# EasyEDA Pro project Schematic.epro

# Schematic Schematic1
Board Name: Board1; Create Date: 2026-01-22; Page Name: P1; Project Name: HackClub Macropad; Schematic Name: Schematic1; Update Date: 2026-01-29; Company: EasyEDA.com; Page Size: A4; Version: V1.0
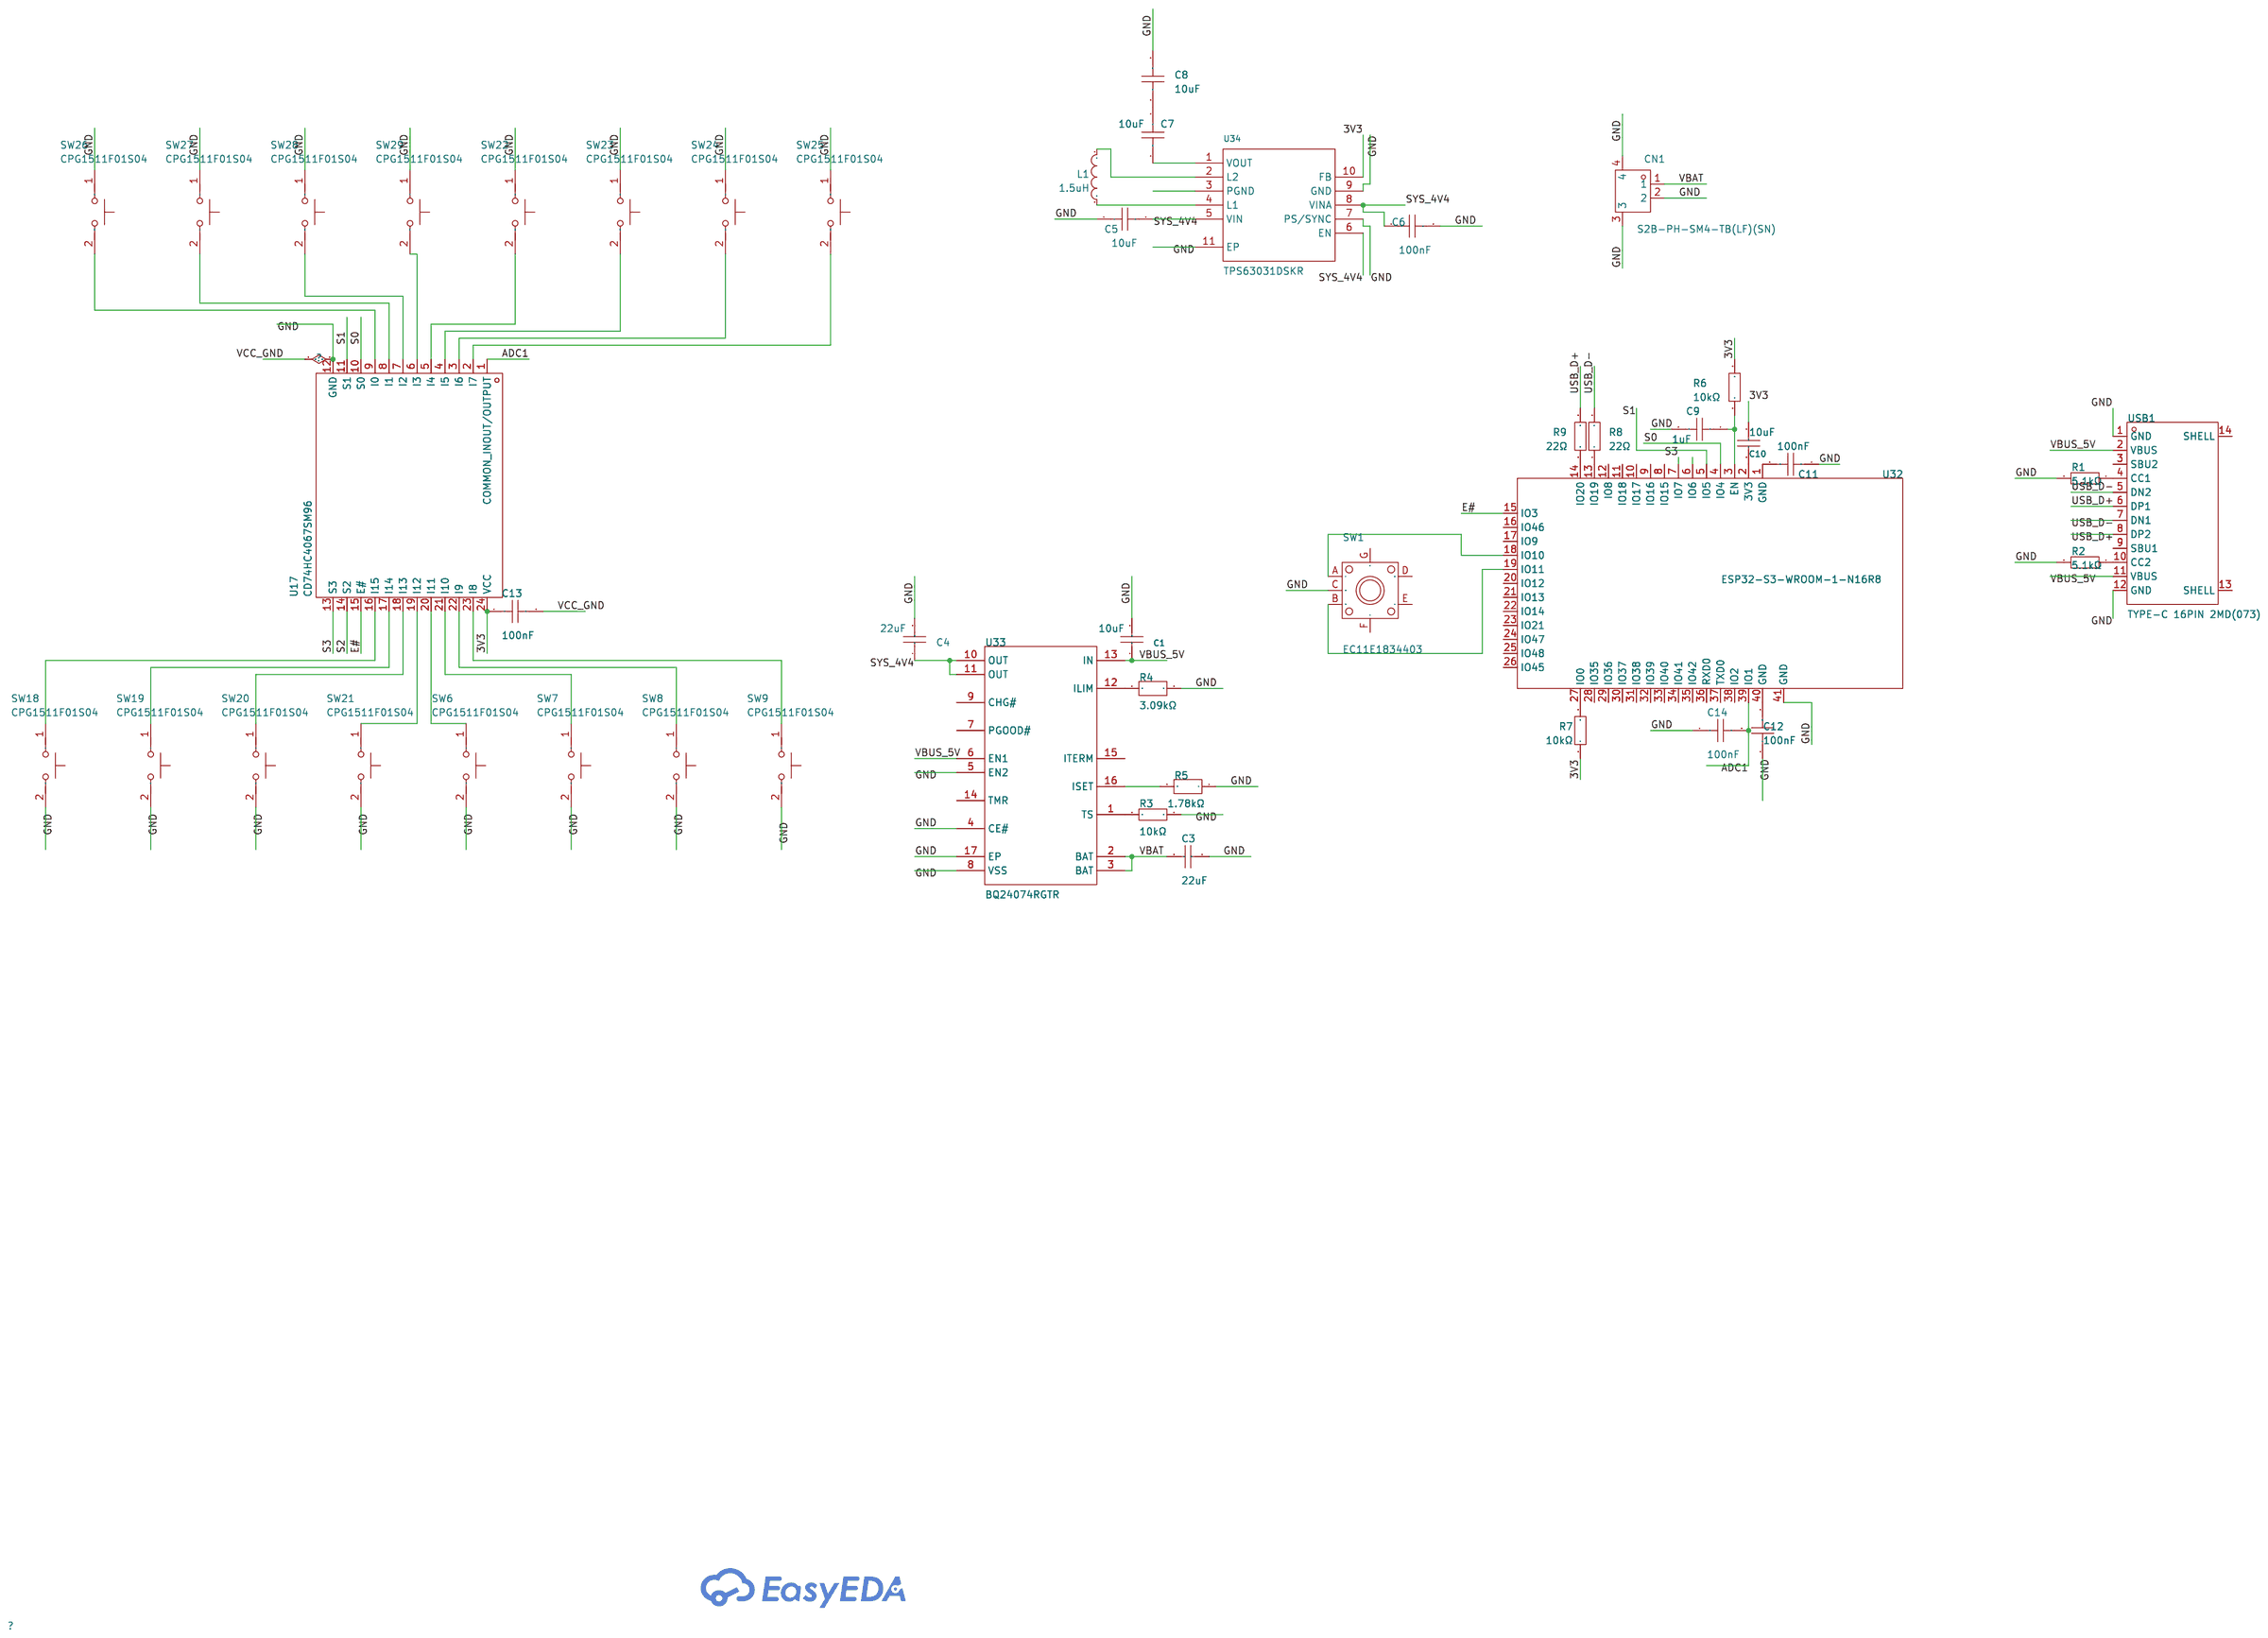
[diagram p0: schematic sheet]

## Parts
C1  10uF  [C0805]
C3  22uF  [C0805]
C4  22uF  [C0805]
C5  10uF  [C0603]
C6  100nF  [C0805]
C7  10uF  [C0603]
C8  10uF  [C0603]
C9  1uF  [C0402]
C10  10uF  [C0805]
C11  100nF  [C0402]
C12  100nF  [C0402]
C13  100nF  [C0402]
C14  100nF  [C0402]
CN1  S2B-PH-SM4-TB(LF)(SN)  [CONN-SMD_P2.00_S2B-PH-SM4-TB-LF-SN]
L1  1.5uH  [IND-SMD_L4.0-W4.0-A]
R1  5.1kΩ  [R0603]
R2  5.1kΩ  [R0603]
R3  10kΩ  [R0805]
R4  3.09kΩ  [R0805]
R5  1.78kΩ  [R1206]
R6  10kΩ  [R0805]
R7  10kΩ  [R0805]
R8  22Ω  [R0402]
R9  22Ω  [R0402]
SW1  EC11E1834403  [SW-TH_EC11E1820402]
SW6  CPG1511F01S04  [KEY-TH_CPG1511F01S0X]
SW7  CPG1511F01S04  [KEY-TH_CPG1511F01S0X]
SW8  CPG1511F01S04  [KEY-TH_CPG1511F01S0X]
SW9  CPG1511F01S04  [KEY-TH_CPG1511F01S0X]
SW18  CPG1511F01S04  [KEY-TH_CPG1511F01S0X]
SW19  CPG1511F01S04  [KEY-TH_CPG1511F01S0X]
SW20  CPG1511F01S04  [KEY-TH_CPG1511F01S0X]
SW21  CPG1511F01S04  [KEY-TH_CPG1511F01S0X]
SW22  CPG1511F01S04  [KEY-TH_CPG1511F01S0X]
SW23  CPG1511F01S04  [KEY-TH_CPG1511F01S0X]
SW24  CPG1511F01S04  [KEY-TH_CPG1511F01S0X]
SW25  CPG1511F01S04  [KEY-TH_CPG1511F01S0X]
SW26  CPG1511F01S04  [KEY-TH_CPG1511F01S0X]
SW27  CPG1511F01S04  [KEY-TH_CPG1511F01S0X]
SW28  CPG1511F01S04  [KEY-TH_CPG1511F01S0X]
SW29  CPG1511F01S04  [KEY-TH_CPG1511F01S0X]
U17  CD74HC4067SM96  [SSOP-24_L8.1-W5.3-P0.65-LS7.8-BL]
U32  ESP32-S3-WROOM-1-N16R8  [WIRELM-SMD_ESP32-S3-WROOM-1]
U33  BQ24074RGTR  [QFN-16_L3.0-W3.0-P0.50-TL-EP1.7]
U34  TPS63031DSKR  [SON-10_L2.5-W2.5-P0.50-TL-EP]
USB1  TYPE-C 16PIN 2MD(073)  [USB-C-SMD_TYPE-C-6PIN-2MD-073]

## Library data of the parts
C1 C10 = CC0805KKX5R7BB106: Capacitance:10uF Tolerance:±10% Tolerance:±10% Voltage Rating:16V Temperature Coefficient:X5R; LCSC Part Name: 10uF ±10% 16V; Supplier Part: C89827; Manufacturer: YAGEO(国巨); Supplier Footprint: 0805; JLCPCB Part Class: Extended Part; Datasheet: https://item.szlcsc.com/datasheet/CC0805KKX5R7BB106/91009.html; Supplier: LCSC; Tolerance: ±10%; Voltage Rating: 16V; Temperature Coefficient: X5R
C3 C4 = CL21A226MPQNNNE: Capacitance:22uF Tolerance:±20% Tolerance:±20% Voltage Rating:10V Temperature Coefficient:X5R; LCSC Part Name: 22uF ±20% 10V; Supplier Part: C29277; Manufacturer: SAMSUNG(三星); Supplier Footprint: 0805; JLCPCB Part Class: Extended Part; Datasheet: https://item.szlcsc.com/datasheet/CL21A226MPQNNNE/30029.html; Supplier: LCSC; Tolerance: ±20%; Voltage Rating: 10V; Temperature Coefficient: X5R
C5 C7 C8 = CL10A106KP8NNNC: Capacitance:10uF Tolerance:±10% Tolerance:±10% Voltage Rating:10V Temperature Coefficient:X5R; LCSC Part Name: 10uF ±10% 10V; Supplier Part: C19702; Manufacturer: SAMSUNG(三星); Supplier Footprint: 0603; JLCPCB Part Class: Basic Part; Datasheet: https://item.szlcsc.com/datasheet/CL10A106KP8NNNC/20411.html; Supplier: LCSC; Tolerance: ±10%; Voltage Rating: 10V; Temperature Coefficient: X5R
C6 = CC0805KRX7R9BB104: Capacitance:100nF Tolerance:±10% Tolerance:±10% Voltage Rating:50V Temperature Coefficient:X7R; LCSC Part Name: 100nF ±10% 50V; Supplier Part: C49678; Manufacturer: YAGEO(国巨); Supplier Footprint: 0805; JLCPCB Part Class: Basic Part; Datasheet: https://item.szlcsc.com/datasheet/CC0805KRX7R9BB104/50686.html; Supplier: LCSC; Tolerance: ±10%; Voltage Rating: 50V; Temperature Coefficient: X7R
C9 = 0402X105K160NT: Capacitance:1uF Tolerance:±10% Tolerance:±10% Voltage Rating:16V Temperature Coefficient:X5R; LCSC Part Name: 1uF ±10% 16V; Supplier Part: C167339; Manufacturer: FH(风华); Supplier Footprint: 0402; JLCPCB Part Class: Extended Part; Datasheet: https://item.szlcsc.com/datasheet/0402X105K160NT/178722.html; Supplier: LCSC; Tolerance: ±10%; Voltage Rating: 16V; Temperature Coefficient: X5R
C11-C14 = CL05B104KB54PNC: Capacitance:100nF Tolerance:±10% Tolerance:±10% Voltage Rating:50V Temperature Coefficient:X7R; LCSC Part Name: 100nF ±10% 50V; Supplier Part: C307331; Manufacturer: SAMSUNG(三星); Supplier Footprint: 0402; JLCPCB Part Class: Basic Part; Datasheet: https://item.szlcsc.com/datasheet/CL05B104KB54PNC/291005.html; Supplier: LCSC; Tolerance: ±10%; Voltage Rating: 50V; Temperature Coefficient: X7R
CN1 = S2B-PH-SM4-TB(LF)(SN): Pins Structure:1x2P Pitch:2mm Mounting Style:Horizontal attachment Reference Series:PH Number of Pins:2P Number of Rows:1 Number of PINs Per Row:2 Row Spacing:- Current Rating (Max):2A Contact Material:Copper alloy Contact Plating:Tin Operating Temperatur; LCSC Part Name: 1x2P 间距:2mm 卧贴 系列:PH; Supplier Part: C295747; Manufacturer: JST; Supplier Footprint: SMD,P=2mm,卧贴; JLCPCB Part Class: Extended Part; Datasheet: https://atta.szlcsc.com/upload/public/pdf/source/20210203/C295747_344B2E64535E381E727D98C302AB61C7.pdf; Supplier: LCSC; Pins Structure: 1x2P; Pitch: 2mm; Mounting Style: Horizontal attachment; Reference Series: PH; Number of Pins: 2P; Number of Rows: 1; Number of PINs Per Row: 2; Current Rating (Max): 2A; Contact Material: Copper alloy; Contact Plating: Tin; Operating Temperature Range: -25℃~+85℃; Rated Voltage (Max): 100V; Plastic Material: PA; Flame Retardant Rating: UL94V-0; Supplementary Features: Auxiliary soldering legs; Colour: Beige; Z-Height of the Board: 5.5mm; X-Length of Bottom Edge on Board (Spacing Line): 7.9mm; Y-Width of Bottom Edge on Board: 8.6mm
L1 = XFL4020-152MEC: Inductance:1.5uH Tolerance:±20% Tolerance:±20% Current Rating:- Current - Saturation(Isat):- DC Resistance(DCR):- Type:Magnetic Shielded Inductor Ratings:-; LCSC Part Name: 1.5uH ±20%; Supplier Part: C3033018; Manufacturer: Coilcraft(线艺); Supplier Footprint: SMD,4x4mm; JLCPCB Part Class: Extended Part; Datasheet: https://www.coilcraft.com/getmedia/50632d43-da1b-4cdb-8ab4-3029cab51df3/xfl4020.pdf; Supplier: LCSC; Tolerance: ±20%; Type: Magnetic Shielded Inductor
R1 R2 = 0603WAF5101T5E: Type:Thick Film Resistor Resistance:5.1kΩ Tolerance:±1% Tolerance:±1% Power(Watts):100mW Voltage-Supply(Max):75V Temperature Coefficient:±100ppm/℃ Temperature Coefficient:±100ppm/℃ Operating Temperature:-55℃~+155℃ Operating Temperature:-55℃~+155℃; LCSC Part Name: 5.1kΩ ±1% 100mW 厚膜电阻; Supplier Part: C23186; Manufacturer: UNI-ROYAL(厚声); Supplier Footprint: 0603; JLCPCB Part Class: Basic Part; Datasheet: https://item.szlcsc.com/datasheet/0603WAF5101T5E/23913.html; Supplier: LCSC; Type: Thick Film Resistor; Tolerance: ±1%; Power(Watts): 100mW; Voltage-Supply(Max): 75V; Temperature Coefficient: ±100ppm/℃; Operating Temperature: -55℃~+155℃
R3 = 0805W8F1002T5E: Type:Thick Film Resistor Resistance:10kΩ Tolerance:±1% Tolerance:±1% Power(Watts):125mW Voltage-Supply(Max):150V Temperature Coefficient:±100ppm/℃ Temperature Coefficient:±100ppm/℃ Operating Temperature:-55℃~+155℃ Operating Temperature:-55℃~+155℃; LCSC Part Name: 10kΩ ±1% 125mW 厚膜电阻; Supplier Part: C17414; Manufacturer: UNI-ROYAL(厚声); Supplier Footprint: 0805; JLCPCB Part Class: Basic Part; Datasheet: https://item.szlcsc.com/datasheet/0805W8F1002T5E/18102.html; Supplier: LCSC; Type: Thick Film Resistor; Tolerance: ±1%; Power(Watts): 125mW; Voltage-Supply(Max): 150V; Temperature Coefficient: ±100ppm/℃; Operating Temperature: -55℃~+155℃
R4 = RT0805BRD073K09L: Type:Thin Film Resistor Resistance:3.09kΩ Tolerance:±0.1% Tolerance:±0.1% Power(Watts):125mW Temperature Coefficient:±25ppm/℃ Temperature Coefficient:±25ppm/℃ Operating Temperature:-55℃~+155℃ Operating Temperature:-55℃~+155℃; LCSC Part Name: 薄膜电阻 3.09kΩ ±0.1% 125mW; Supplier Part: C865456; Manufacturer: YAGEO(国巨); Supplier Footprint: 0805; JLCPCB Part Class: Extended Part; Datasheet: https://item.szlcsc.com/datasheet/RT0805BRD073K09L/925537.html; Supplier: LCSC; Type: Thin Film Resistor; Tolerance: ±0.1%; Power(Watts): 125mW; Temperature Coefficient: ±25ppm/℃; Operating Temperature: -55℃~+155℃
R5 = RT1206BRD071K78L: Type:Thin Film Resistor Resistance: Tolerance:±0.1% Tolerance:±0.1% Power(Watts):250mW Overload Voltage (Max): Temperature Coefficient:±25ppm/℃ Temperature Coefficient:±25ppm/℃ Operating Temperature Range:-55℃~+155℃ Operating Temperature Range:-55℃~+155℃; LCSC Part Name: 薄膜电阻 1.78kΩ ±0.1% 250mW; Supplier Part: C706404; Manufacturer: YAGEO(国巨); Supplier Footprint: 1206; JLCPCB Part Class: Extended Part; Datasheet: https://atta.szlcsc.com/upload/public/pdf/source/20200720/C706404_090B223C8D5F603C04EDF7E7249F9860.pdf; Supplier: LCSC; Type: Thin Film Resistor; Tolerance: ±0.1%; Power(Watts): 250mW; Temperature Coefficient: ±25ppm/℃; Operating Temperature Range: -55℃~+155℃
R6 R7 = RC0805FR-0710KL: Type:Thick Film Resistor Resistance:10kΩ Tolerance:±1% Tolerance:±1% Power(Watts):125mW Voltage-Supply(Max):150V Temperature Coefficient:±100ppm/℃ Temperature Coefficient:±100ppm/℃ Operating Temperature:-55℃~+155℃ Operating Temperature:-55℃~+155℃; LCSC Part Name: 厚膜电阻 10kΩ ±1% 125mW; Supplier Part: C84376; Manufacturer: YAGEO(国巨); Supplier Footprint: 0805; JLCPCB Part Class: Extended Part; Datasheet: https://item.szlcsc.com/datasheet/RC0805FR-0710KL/85546.html; Supplier: LCSC; Type: Thick Film Resistor; Tolerance: ±1%; Power(Watts): 125mW; Voltage-Supply(Max): 150V; Temperature Coefficient: ±100ppm/℃; Operating Temperature: -55℃~+155℃
R8 R9 = RC0402FR-0722RL: Type:Thick Film Resistors Resistance: Tolerance:±1% Tolerance:±1% Power(Watts): Overload Voltage (Max): Temperature Coefficient:±100ppm/℃ Temperature Coefficient:±100ppm/℃ Operating Temperature Range:-55℃~+155℃ Operating Temperature Range:-55℃~+155℃; LCSC Part Name: 厚膜电阻 22Ω ±1% 62.5mW; Supplier Part: C114765; Manufacturer: YAGEO(国巨); Supplier Footprint: 0402; JLCPCB Part Class: Extended Part; Datasheet: https://atta.szlcsc.com/upload/public/pdf/source/20180821/C275644_0D56F95EFF785E7D9A1FEF436B37DA78.pdf; Supplier: LCSC; Type: Thick Film Resistors; Tolerance: ±1%; Temperature Coefficient: ±100ppm/℃; Operating Temperature Range: -55℃~+155℃
SW1 = EC11E1834403: LCSC Part Name: 编码器; Supplier Part: C361165; Manufacturer: ALPSALPINE(阿尔卑斯阿尔派); Supplier Footprint: 插件; JLCPCB Part Class: Extended Part; Datasheet: https://atta.szlcsc.com/upload/public/pdf/source/20190109/C361167_8025A1363C62EF4BA37C0EA12E1AE3EA.pdf; Supplier: LCSC
SW6-SW9 SW18-SW29 = CPG1511F01S04: Axis Type:Red axis Operating Voltage:2V~12V Operating Voltage:2V~12V Pin:2 Mechanical Life:80 million times Operation Force:45gf@±10gf Conduction Travel:1.8mm Total Travel:3.6mm Operating Temperature:-10℃~+70℃ Operating Temperature:-10℃~+70℃; LCSC Part Name: BOX 红轴; Supplier Part: C400226; Manufacturer: Kailh(凯华); Supplier Footprint: 插件; JLCPCB Part Class: Extended Part; Datasheet: https://atta.szlcsc.com/upload/public/pdf/source/20190626/C400226_74917CF00C09065EB4010B1E948F36C3.pdf; Supplier: LCSC; Axis Type: Red axis; Operating Voltage: 2V~12V; Pin: 2; Mechanical Life: 80 million times; Operation Force: 45gf@±10gf; Conduction Travel: 1.8mm; Total Travel: 3.6mm; Operating Temperature: -10℃~+70℃
U17 = CD74HC4067SM96: Switch Circuit:16:1 Number of Channels:16 Voltage - Supply:2V~6V Voltage - Supply:2V~6V Turn-on time:- Ron:70Ω Turn-off time:- Operating Temperature:-55℃~+125℃ Operating Temperature:-55℃~+125℃ Con:5pF Bandwidth:89MHz Propagation Delay (tpd):15ns; LCSC Part Name: 高速CMOS逻辑16通道模拟多路复用器/解复用器; Supplier Part: C98457; Manufacturer: TI(德州仪器); Supplier Footprint: SSOP-24-208mil; JLCPCB Part Class: Extended Part; Datasheet: https://www.ti.com/cn/lit/gpn/cd74hc4067; Supplier: LCSC; Switch Circuit: 16:1; Number of Channels: 16; Voltage - Supply: 2V~6V; Ron: 70Ω; Operating Temperature: -55℃~+125℃; Con: 5pF; Bandwidth: 89MHz; Propagation Delay (tpd): 15ns
U32 = ESP32-S3-WROOM-1-N16R8: LCSC Part Name: 通用型Wi-Fi+低功耗蓝牙MCU模组; Supplier Part: C2913202; Manufacturer: ESPRESSIF(乐鑫); Supplier Footprint: SMD,25.5x18mm; JLCPCB Part Class: Extended Part; Datasheet: https://item.szlcsc.com/datasheet/ESP32-S3-WROOM-1-N16R8/3198300.html; Supplier: LCSC
U33 = BQ24074RGTR: The Chip Type:- Voltage - Supply:4.35V~26V Voltage - Supply:4.35V~26V Charge Current - Max:- Charging Saturation Voltage:4.2V Type of Battery:Lithium-ion/Polymer Number of Cells:1 Number of Cells:1 Operating Temperature:-40℃~+85℃ Operating Temperature:-40; LCSC Part Name: USB友好型1.5A锂离子电池充电器和电源路径管理IC; Supplier Part: C54313; Manufacturer: TI(德州仪器); Supplier Footprint: QFN-16-EP(3x3); JLCPCB Part Class: Extended Part; Datasheet: https://www.ti.com/cn/lit/gpn/bq24074; Supplier: LCSC; Voltage - Supply: 4.35V~26V; Charging Saturation Voltage: 4.2V; Type of Battery: Lithium-ion/Polymer; Number of Cells: 1; Operating Temperature: -40℃~+85℃
U34 = TPS63031DSKR: Function:Buck-Boost Voltage - Supply:1.8V~5.5V Voltage - Supply:1.8V~5.5V Output Voltage:3.3V Output Voltage:3.3V Output Current:900mA Frequency - Switching:2.4MHz Frequency - Switching:2.4MHz Operating Temperature:-40℃~+125℃@(TJ) Operating Temperature:-4; LCSC Part Name: 高效单电感降 压-升压转换器; Supplier Part: C15516; Manufacturer: TI(德州仪器); Supplier Footprint: SON-10-EP(2.5x2.5); JLCPCB Part Class: Extended Part; Datasheet: https://www.ti.com/cn/lit/gpn/tps63031; Supplier: LCSC; Function: Buck-Boost; Voltage - Supply: 1.8V~5.5V; Output Voltage: 3.3V; Output Current: 900mA; Frequency - Switching: 2.4MHz; Operating Temperature: -40℃~+125℃@(TJ); Synchronous Rectifier: Yes; Number of Outputs: 1; Topology: Buck-Boost; Quiescent Current: 25uA; Switch tube (built-in/external): Built-in; Output Type: Fixed
USB1 = TYPE-C 16PIN 2MD(073): Connector Type:Type-C Protocol Standard:- Gender:Female Mounting Type:Surface Mount, Right Angle Number of Contacts:16P Number of Ports:1 Current Rating-Power:3A Voltage Rating:5V Connect-Disconnect Life:5,000 times Supplementary Features:- Center Height:; LCSC Part Name: 16P卧贴母座; Supplier Part: C2765186; Manufacturer: SHOU HAN(首韩); Supplier Footprint: SMD; JLCPCB Part Class: Extended Part; Datasheet: https://item.szlcsc.com/datasheet/TYPE-C%252016PIN%25202MD(073)/2901843.html; Supplier: LCSC; Connector Type: Type-C; Gender: Female; Mounting Type: Surface Mount, Right Angle; Number of Contacts: 16P; Number of Ports: 1; Current Rating-Power: 3A; Voltage Rating: 5V; Connect-Disconnect Life: 5,000 times; Detection color: Black; Operating Temperature: -25℃~+85℃

## Nets
3V3: C10.2 C13.1 R6.2 R7.1 U17.24(VCC) U34.10(FB)
GND: C1.2 C3.2 C4.2 C5.1 C6.2 C8.2 C9.2 C11.1 C12.1 C13.2 C14.1 CN1.2 CN1.3 CN1.4 R1.2 R2.2 R3.2 R4.2 R5.1 SW1.C SW6.2 SW7.2 SW8.2 SW9.2 SW18.2 SW19.2 SW20.2 SW21.2 SW22.1 SW23.1 SW24.1 SW25.1 SW26.1 SW27.1 SW28.1 SW29.1 U17.12(GND) U32.41(GND) U33.4(CE#) U33.5(EN2) U33.8(VSS) U33.17(EP) U34.7(PS/SYNC) U34.9(GND) U34.11(EP) USB1.1(GND) USB1.12(GND)
VBAT: C3.1 CN1.1 U33.2(BAT) U33.3(BAT)
VBUS_5V: C1.1 U33.6(EN1) U33.13(IN) USB1.2(VBUS) USB1.11(VBUS)
ADC1: C14.2 U17.1(COMMON INOUT/OUTPUT) U32.39(IO1)
E#: U17.15(E#) U32.15(IO3)
S0: U17.10(S0) U32.4(IO4)
S1: U17.11(S1) U32.5(IO5)
S2: U17.14(S2)
S3: U17.13(S3) U32.7(IO7)
SYS_4V4: C4.1 C5.2 C6.1 U33.10(OUT) U33.11(OUT) U34.5(VIN) U34.6(EN) U34.8(VINA)
USB_D+: R9.2 USB1.6(DP1) USB1.8(DP2)
USB_D-: R8.2 USB1.5(DN2) USB1.7(DN1)
Net-(C7-1): C7.1 U34.1(VOUT)
Net-(C7-2): C7.2 C8.1
Net-(C9-1): C9.1 R6.1 U32.3(EN)
Net-(C10-1): C10.1 U32.2(3V3)
Net-(C11-2): C11.2 U32.1(GND)
Net-(C12-2): C12.2 U32.40(GND)
Net-(L1-1): L1.1 U34.2(L2)
Net-(L1-2): L1.2 U34.4(L1)
Net-(R1-1): R1.1 USB1.4(CC1)
Net-(R2-1): R2.1 USB1.10(CC2)
Net-(R3-1): R3.1 U33.1(TS)
Net-(R4-1): R4.1 U33.12(ILIM)
Net-(R5-2): R5.2 U33.16(ISET)
Net-(R7-2): R7.2 U32.27(IO0)
Net-(R8-1): R8.1 U32.13(IO19)
Net-(R9-1): R9.1 U32.14(IO20)
Net-(SW1-A): SW1.A U32.18(IO10)
Net-(SW1-B): SW1.B U32.19(IO11)
Net-(SW6-1): SW6.1 U17.20(I11)
Net-(SW7-1): SW7.1 U17.21(I10)
Net-(SW8-1): SW8.1 U17.22(I9)
Net-(SW9-1): SW9.1 U17.23(I8)
Net-(SW18-1): SW18.1 U17.16(I15)
Net-(SW19-1): SW19.1 U17.17(I14)
Net-(SW20-1): SW20.1 U17.18(I13)
Net-(SW21-1): SW21.1 U17.19(I12)
Net-(SW22-2): SW22.2 U17.5(I4)
Net-(SW23-2): SW23.2 U17.4(I5)
Net-(SW24-2): SW24.2 U17.3(I6)
Net-(SW25-2): SW25.2 U17.2(I7)
Net-(SW26-2): SW26.2 U17.9(I0)
Net-(SW27-2): SW27.2 U17.8(I1)
Net-(SW28-2): SW28.2 U17.7(I2)
Net-(SW29-2): SW29.2 U17.6(I3)

Not connected (* = marked no-connect by the designer): SW1 D E F G; U32 6(IO6) 8(IO15) 9(IO16) 10(IO17) 11(IO18) 12(IO8) 16(IO46) 17(IO9) 20(IO12) 21(IO13) 22(IO14) 23(IO21) 24(IO47) 25(IO48) 26(IO45) 28(IO35) 29(IO36) 30(IO37) 31(IO38) 32(IO39) 33(IO40) 34(IO41) 35(IO42) 36(RXD0) 37(TXD0) 38(IO2); U33 7(PGOOD#) 9(CHG#) 14(TMR) 15(ITERM); U34 3(PGND); USB1 3(SBU2) 9(SBU1) 13(SHELL) 14(SHELL)
